# EAGLE design temperature-sensor (EAGLE 4.16)
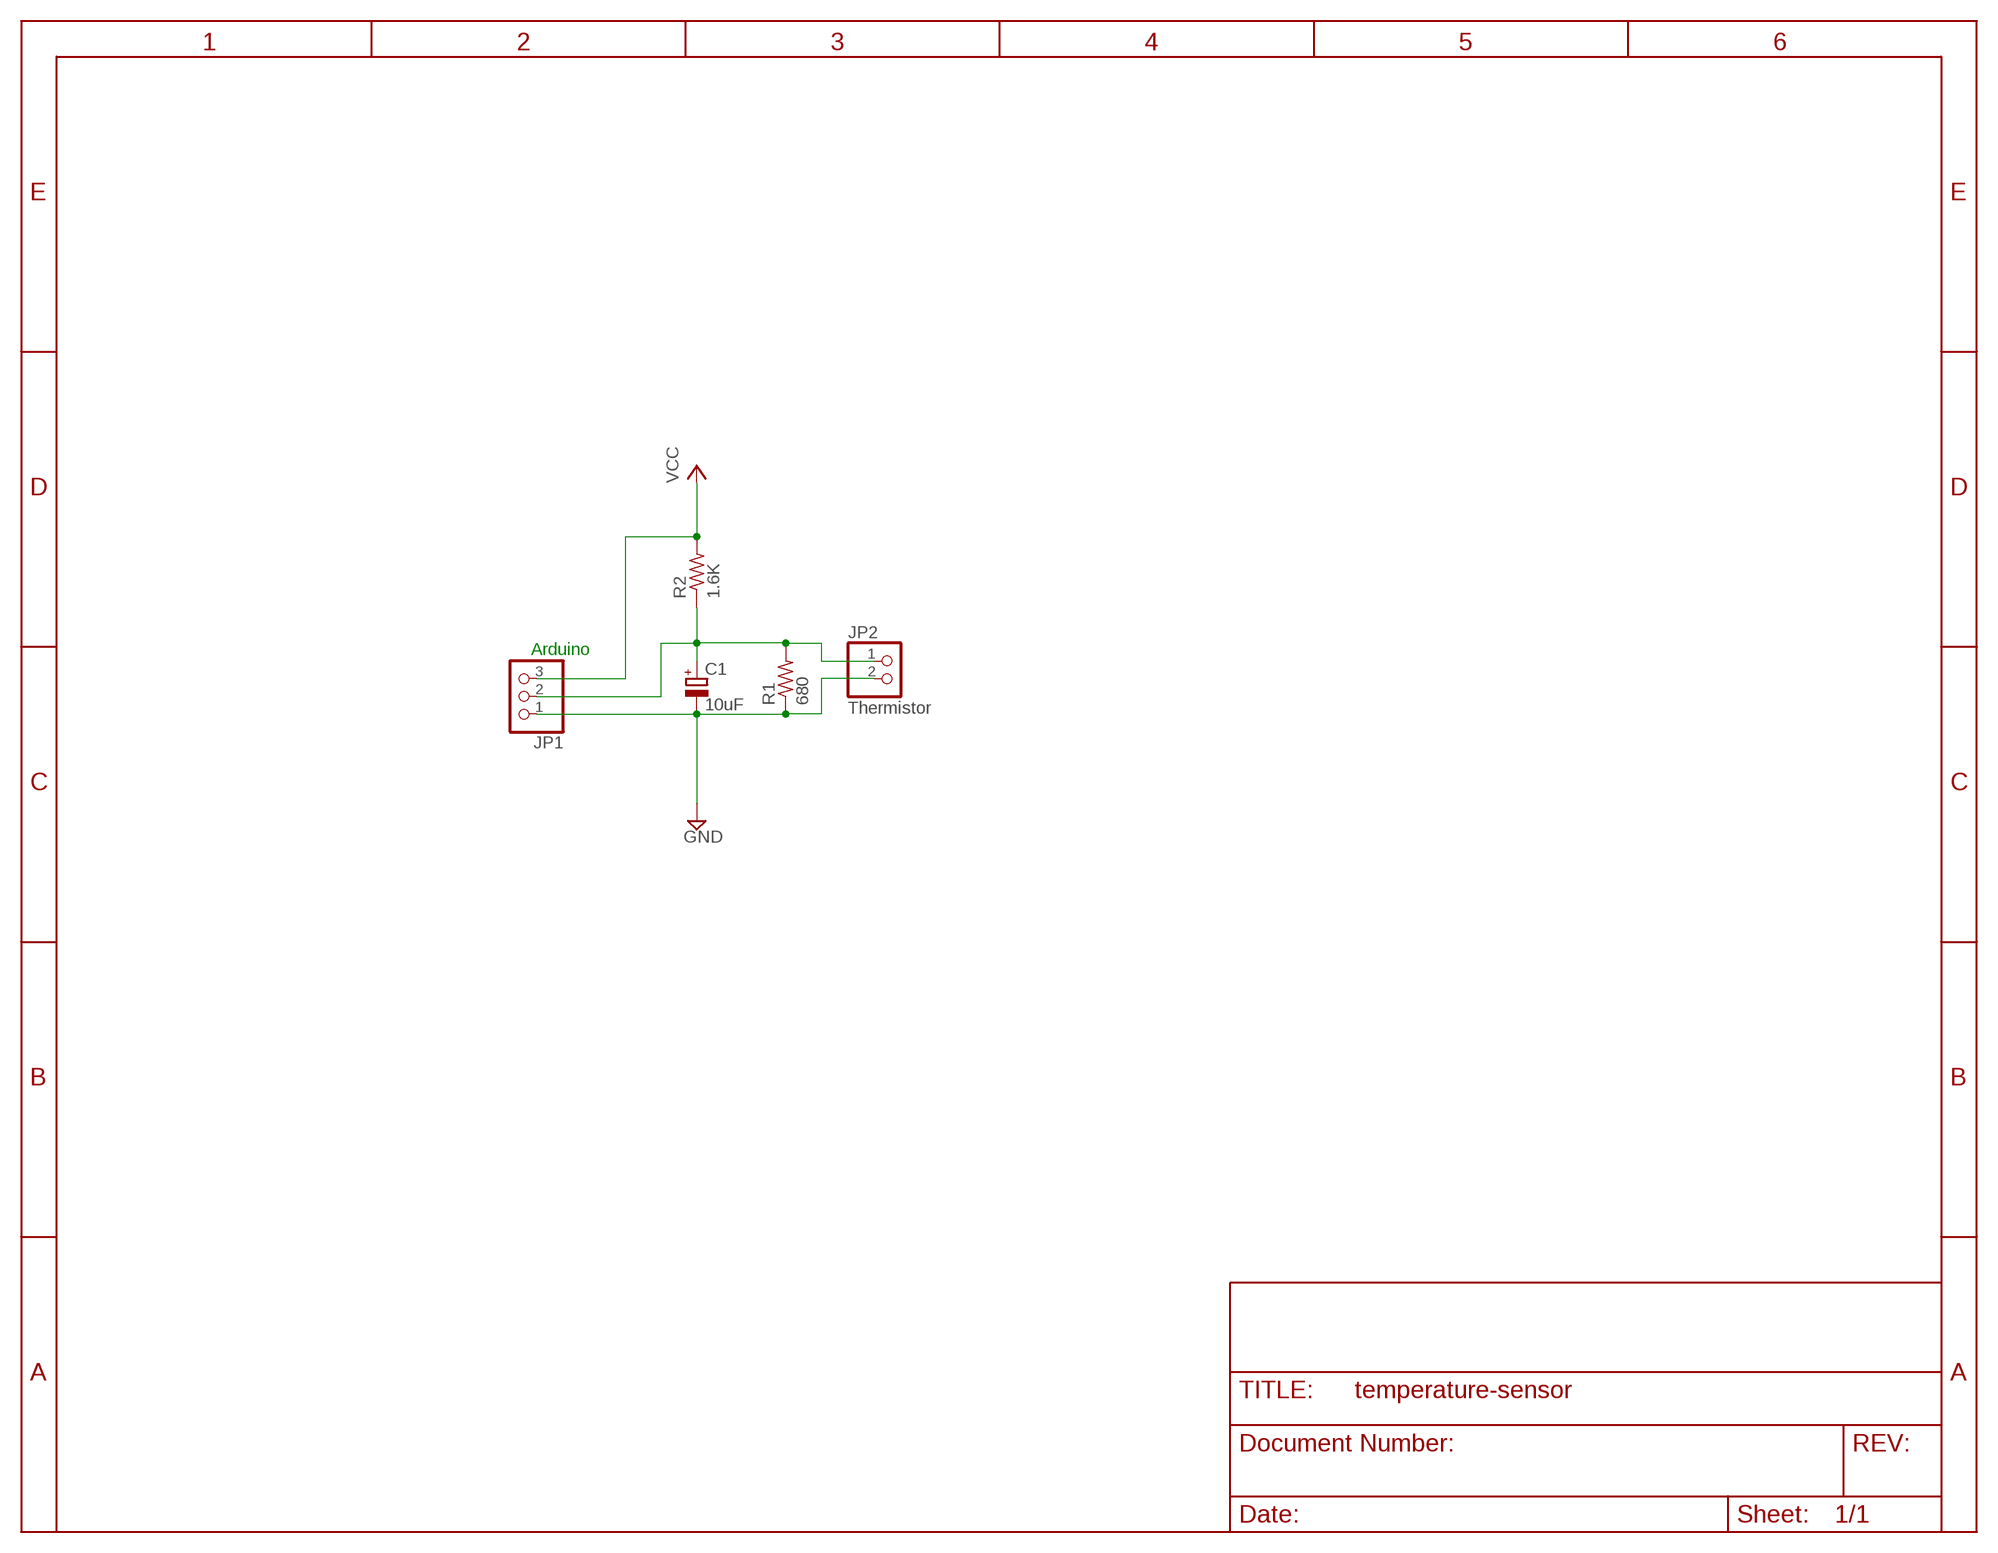
[diagram p0: schematic, sheet 1]

## Parts
C1  10uF  CPOL-EUE5-6  [E5-6]
JP1  PINHD-1X3  [1X03]
JP2  Thermistor  PINHD-1X2  [1X02]
R1  680  R-US_0207/7  [0207/7]
R2  1.6K  R-US_0207/7  [0207/7]

## Nets
GND: C1.- JP1.1 JP2.2 R1.1
N$2: C1.+ JP1.2 JP2.1 R1.2 R2.1
VCC: JP1.3 R2.2

## Notes on the sheet
- Arduino

## Library data of the parts
C1 = rcl:CPOL-EU: POLARIZED CAPACITOR, European symbol
JP1 = pinhead:PINHD-1X3: PIN HEADER
JP2 = pinhead:PINHD-1X2: PIN HEADER
R1 R2 = rcl:R-US_: RESISTOR, American symbol

## Net classes
0 default: width 0.635 mm

## Board
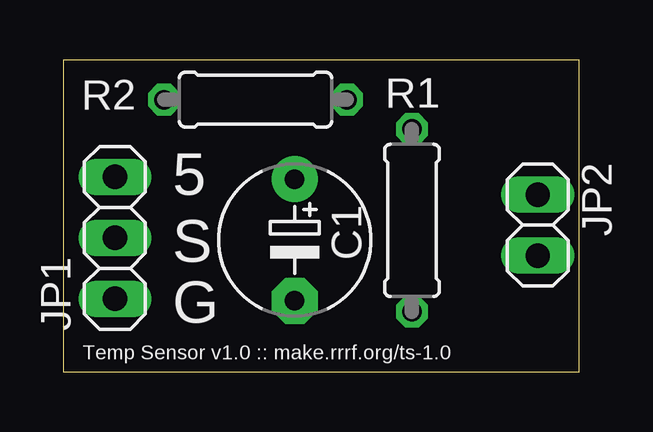
[diagram p1: board, top side]
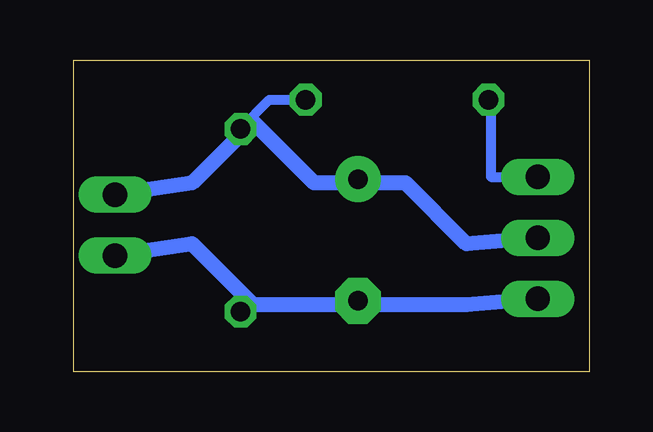
[diagram p2: board, bottom side, seen from below]

Size 21.49 x 13.02 mm. Coordinates in mm from the lower left corner, seen from the top.
Outline: 0,0 21.49,0 21.49,13.02 0,13.02 0,0
Copper layers (1*16): Top 0.035mm / dielectric 1.5mm / Bottom 0.035mm
Design rules "default": minimum track width 10mil, minimum drill 24mil, track to track 8mil, track to pad 8mil, pad to pad 8mil, via to via 8mil, smd to smd 8mil, copper to edge 40mil, drill to drill 8mil, minimum pad ring 10mil, minimum via ring 8mil, stop-mask expansion 4mil, vias tented up to drill 0mil, thermal gap 10mil

### Footprints (pad centres in the part's own frame; a part is rotated, then mirrored left to right if it is on the bottom)
E5-6 = drill 0.813 pad 1.905 round: + -2.54,0 | drill 0.813 pad 1.905 octagon: - 2.54,0
1X03 = drill 1.016 long: 1 -2.54,0; 2 0,0; 3 2.54,0
1X02 = drill 1.016 long: 1 -1.27,0; 2 1.27,0
0207/7 = drill 0.813 octagon: 1 -3.81,0; 2 3.81,0

### Placement (x,y rotation side)
C1  9.65,5.51 270 top
JP1  2.15,5.6 90 top
JP2  19.77,6.13 270 top
R1  14.53,6.32 90 top
R2  8.01,11.36 180 top

### Tracks (layer width: path | path; a pad name or v marks a point on that pad's centre or on a via)
GND
  Bottom 0.635: 14.01,2.81 16.55,5.35 JP2.2 | JP1.1 5.12,2.81 8.93,2.81 C1.- 10.2,2.81 14.01,2.81 | 14.01,2.81 R1.1
N$2
  Bottom 0.406: R1.2 14.53,10.16 13.33,11.36 R2.1
  Bottom 0.635: 14.01,10.43 16.55,7.89 JP2.1 | JP1.2 5.12,5.35 7.66,7.89 8.93,7.89 C1.+ 10.2,7.89 11.47,7.89 14.01,10.43 | 14.01,10.43 R1.2
VCC
  Bottom 0.406: JP1.3 4.11,8.14 4.11,11.36 R2.2

### Text on the board
tPlace: 5 | S | G | Temp Sensor v1.0 :: make.rrrf.org/ts-1.0